# Altium schematic sheet Voeding.SchDoc
size A4; SheetNumber: 1; SheetTotal: 2
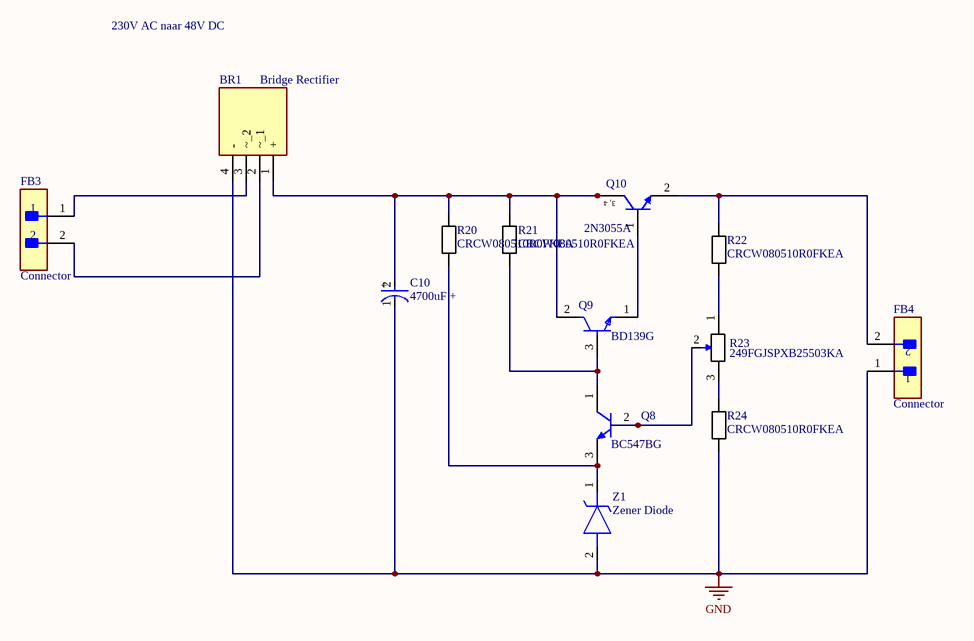
[diagram p0: Voeding.SchDoc]

## Parts
BR1  Bridge Rectifier  [GBU4KE351]
C10  4700uF +  [Elco 4700uF]
FB3  Connector  [Connector]
FB4  Connector  [Connector]
Q8  BC547BG  [BC547]
Q9  BD139G  [BD139]
Q10  2N3055A  [2N3055]
R20  CRCW080510R0FKEA  [0805]
R21  CRCW080510R0FKEA  [0805]
R22  CRCW080510R0FKEA  [0805]
R23  249FGJSPXB25503KA  [Potentiometer 15mm]
R24  CRCW080510R0FKEA  [0805]
Z1  Zener Diode  [Zener Diode]

## Nets
GND: BR1.4(-) C10.1(C) FB4.1 R24.1 Z1.2(A)
NetBR1_1: BR1.1(+) C10.2(A) Q9.2(C) Q10.3(C) Q10.4(C) R20.2 R21.2
NetBR1_2: BR1.2(~_1) FB3.2
NetBR1_3: BR1.3(~_2) FB3.1
NetFB4_2: FB4.2 Q10.2(E) R22.2
NetQ8_1: Q8.1(C) Q9.3(B) R21.1
NetQ8_2: Q8.2(B) R23.2
NetQ8_3: Q8.3(E) R20.1 Z1.1(K)
NetQ9_1: Q9.1(E) Q10.1(B)
NetR22_1: R22.1 R23.1
NetR23_3: R23.3 R24.2

## Notes on the sheet
- 230V AC naar 48V DC
- (in symbol 2N3055) 3, 4
- (in symbol Elco 4700uF) +

## Library data of the parts
BR1 = GBU4K-E3_51: Manufacturer_Name: Vishay; Manufacturer_Part_Number: GBU4K-E3/51; Datasheet Link: https://4donline.ihs.com/images/VipMasterIC/IC/VISH/VISH-S-A0001811512/VISH-S-A0001811512-1.pdf?hkey=6D3A4C79FDBF58556ACFDE234799DDF0; Height: 18.8mm; Mouser Part Number: 625-GBU4K-E3/51; Mouser Price/Stock: https://www.mouser.co.uk/ProductDetail/Vishay-General-Semiconductor/GBU4K-E3-51?qs=nHKQP18abP9%2FYmEys%252Budwg%3D%3D; Arrow Part Number: GBU4K-E3/51; Arrow Price/Stock: https://www.arrow.com/en/products/gbu4k-e351/vishay?region=europe
C10 = Elco 4700uF
FB3 FB4 = Connector: Ferrite Bead; Manufacturer_Name: ABRACON; Manufacturer_Part_Number: ACML-0805-500-T; Datasheet Link: https://abracon.com/Magnetics/new/ACML-0805.pdf; Height: 1.05mm; Mouser Part Number: 815-ACML-0805-500T; Mouser Price/Stock: https://www.mouser.co.uk/ProductDetail/ABRACON/ACML-0805-500-T?qs=qw2lGDycG5tBjukxHQX6NA%3D%3D; Arrow Part Number: ACML-0805-500-T; Arrow Price/Stock: https://www.arrow.com/en/products/acml-0805-500-t/abracon
Q8 = Transistor - BC547: Amplifier Transistor, NPN Silicon, 3-Pin TO-92, Pb-Free, Bulk Box; Manufacturer: On Semiconductor; IC Continuous (A): 0.1; fT Min (MHz): 150; Packing: Bulk Box; RoHS: TRUE; PackageVersion: Rev. AM; Mounting Technology: Through Hole; Polarity: NPN; PackageReference: TO-92-3-29-11_AM_SL; DatasheetVersion: Rev. 7; ComponentLink2URL: http://www.onsemi.com/pub_link/Collateral/BC546-D.PDF; ComponentLink1Description: Manufacturer URL; ComponentLink3URL: http://www.onsemi.cn/pub_link/Collateral/2N6426-D.PDF; PackageDescription: 3-Pin Transistor Outline, Body 4.825 x 3.685 mm, Pitch 1.27 mm; ComponentLink2Description: Datasheet; ComponentLink1URL: http://www.onsemi.com/; PartNumber: BC547BG; ComponentLink3Description: Package Specification
Q9 = Transistor - BD139: NexarPartId: 354669; Manufacturer Lifecycle Status: ACTIVE; Collector Emitter Saturation Voltage: 500mV; Collector Emitter Breakdown Voltage: 80V; hFE Min: 25; Element Configuration: Single; Max Power Dissipation: 1.25W; Max Junction Temperature (Tj): 150°C; Emitter Base Voltage (VEBO): 5V; Max Collector Current: 1.5A; Number of Elements: 1; Polarity: NPN; Min Operating Temperature: -55°C; Max Operating Temperature: 150°C; Voltage Rating (DC): 80V; REACH SVHC: No SVHC; Radiation Hardening: No; Contact Plating: Tin; Schedule B: 8541290080, 8541290080|8541290080, 8541290080|8541290080|8541290080, 8541290080|8541290080|8541290080|8541290080; Number of Pins: 3; Case/Package: TO-225; Lifecycle Status: Production; Collector Base Voltage (VCBO): 80V; Weight: 4.535924g; Height: 11.04mm; RoHS: Compliant; Width: 2.66mm; Collector Emitter Voltage (VCEO): 80V; Lead Free: Lead Free; Current Rating: 1.5A; Power Dissipation: 1.25W; Packaging: Bulk; Length: 7.74mm
Q10 = 2N3055: Complementary Silicon High-Power Transistor, 3-Pin TO-204, Tray; Manufacturer: On Semiconductor; Polarity: NPN; IC Continuous (A): 15; fT Min (MHz): 0.8; Note1: 0; ComponentLink1Description: Manufacturer URL; ComponentLink1URL: http://www.onsemi.com/; Mounting Technology: Through Hole; ComponentLink2URL: http://www.onsemi.com/pub_link/Collateral/2N3055A-D.PDF; PartNumber: 2N3055A; ComponentLink3Description: Package Specification; PackageDescription: 2-Pin Transistor Outline, Body 39.37 x 26.67 mm, Pitch 10.92 mm; Packing: Tray; ComponentLink3URL: http://www.onsemi.com/pub_link/Collateral/1-07.PDF; ComponentLink2Description: Datasheet; DatasheetVersion: Rev. 7; RoHS: FALSE; PackageVersion: Rev. Z, 05/1988; PackageReference: TO-204-3-1-07
R20-R22 R24 = Resistor 0805: Manufacturer: Vishay Dale; Part Number: CRCW080510R0FKEA
R23 = Potentiometer: 249FGJSPXB25503KA Res Cermet POT 50K Ohm 20% 1W 1(Elec)/1(Mech)Turn 6.35mm Pin Panel Mount/Through Hole Bulk; NexarPartId: 42669055; Number of Turns: 1; Tolerance: 10%; Voltage Rating: 224V; Insulation Resistance: 1GΩ; Hole Diameter: 9.525mm; Resistance: 50kΩ; Temperature Coefficient: 100ppm/°C; RoHS: Compliant; Length: 12.7mm; Power Rating: 1W; Contact Plating: Tin; Min Operating Temperature: -55°C; Composition: Cermet, Potentiometer; Number of Gangs: 1; Max Operating Temperature: 125°C; Depth: 12.7mm; Termination: Pin; REACH SVHC: Unknown; Type: Potentiometer; Mount: Panel, Through Hole; Military Standard: Not; Height: 13.11mm; Width: 12.7mm
Z1 = Zener Diode: Manufacturer_Name: Diodes Incorporated; Manufacturer_Part_Number: MMSZ5245B-7-F; Datasheet Link: https://www.diodes.com//assets/Datasheets/ds18010.pdf; Height: 1.45mm; Mouser Part Number: 621-MMSZ5245B-F; Mouser Price/Stock: https://www.mouser.co.uk/ProductDetail/Diodes-Incorporated/MMSZ5245B-7-F?qs=cvwh0phLhFKAGvhg07nX2Q%3D%3D; Arrow Part Number: MMSZ5245B-7-F; Arrow Price/Stock: https://www.arrow.com/en/products/mmsz5245b-7-f/diodes-incorporated?region=nac